# Altium project MCU_Control&ADDeteect2.PrjPcb
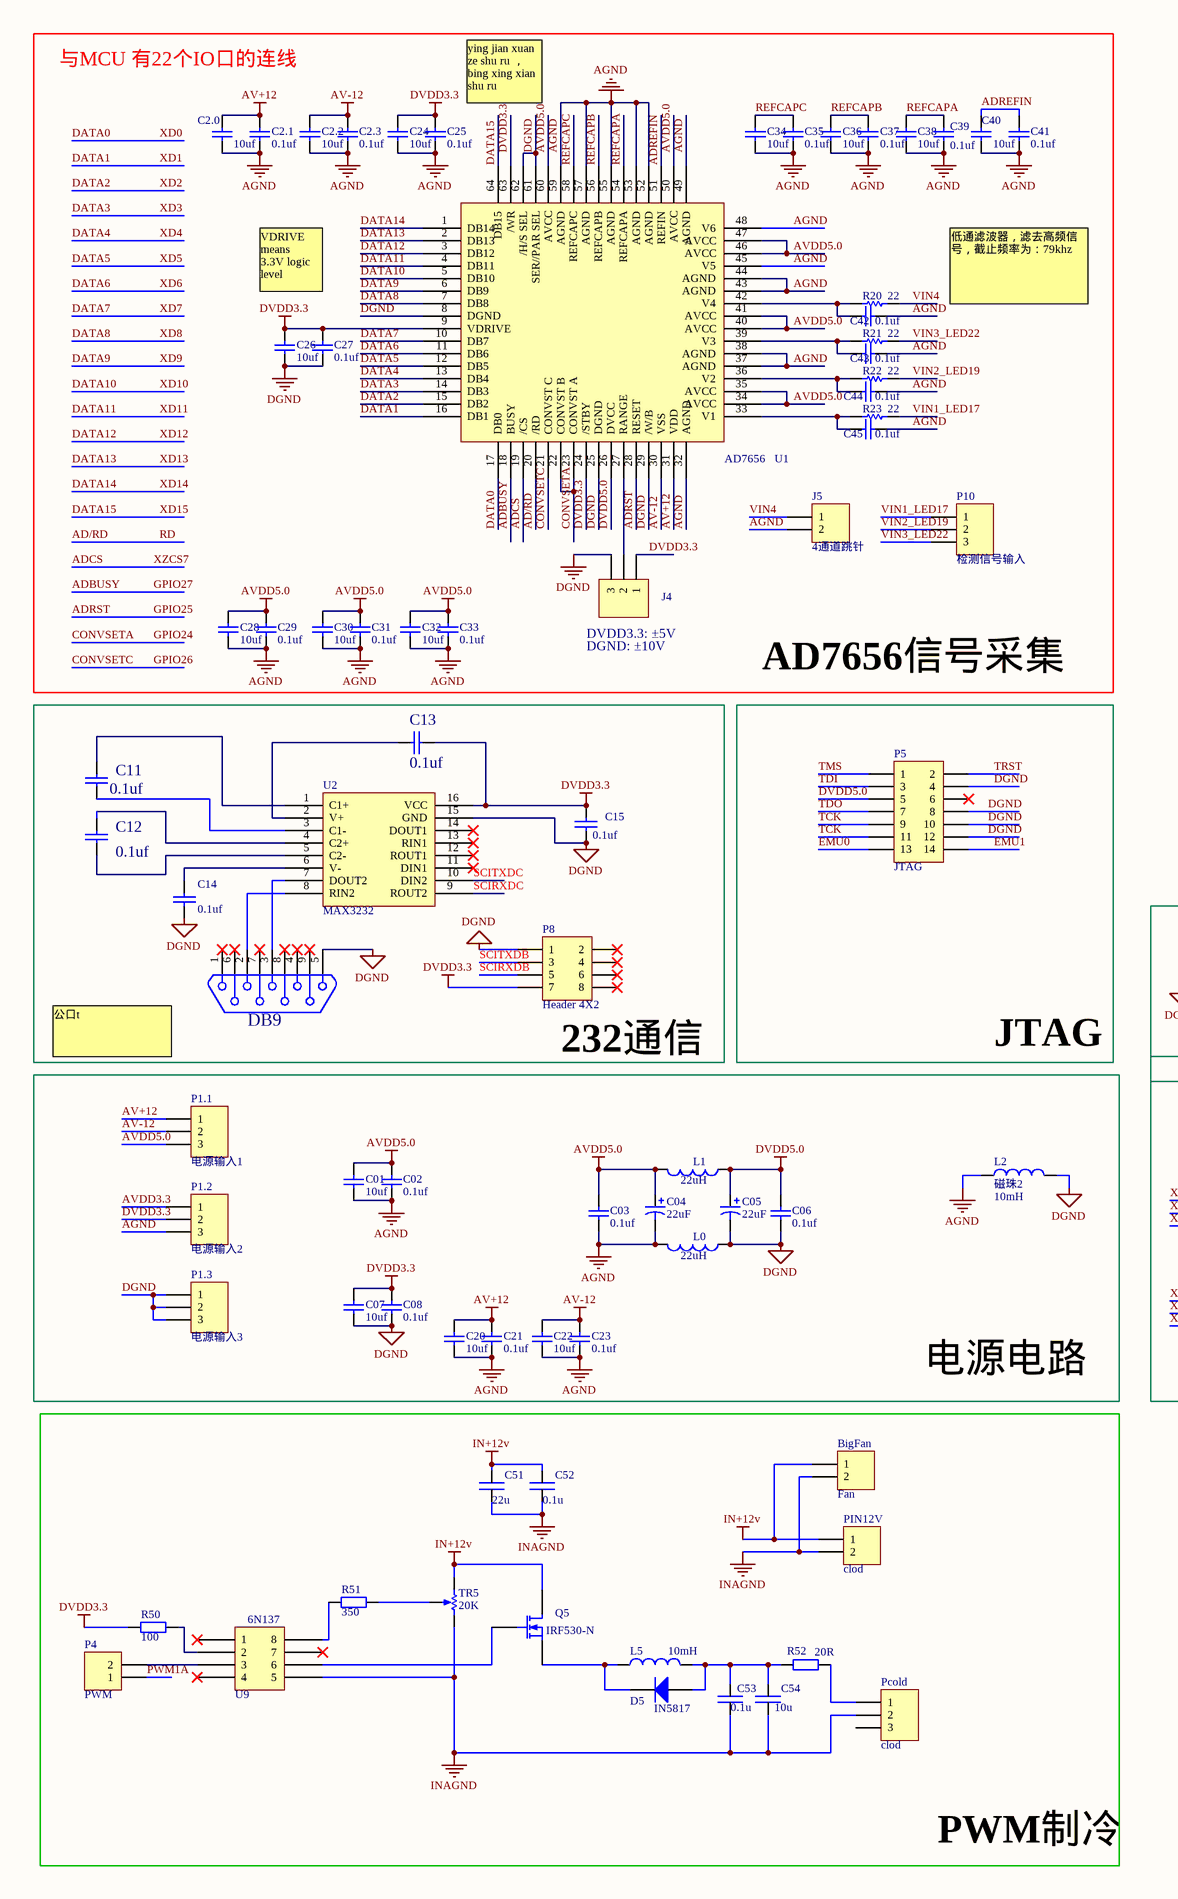
[diagram p0: MCU_Control_Board.SchDoc, left]
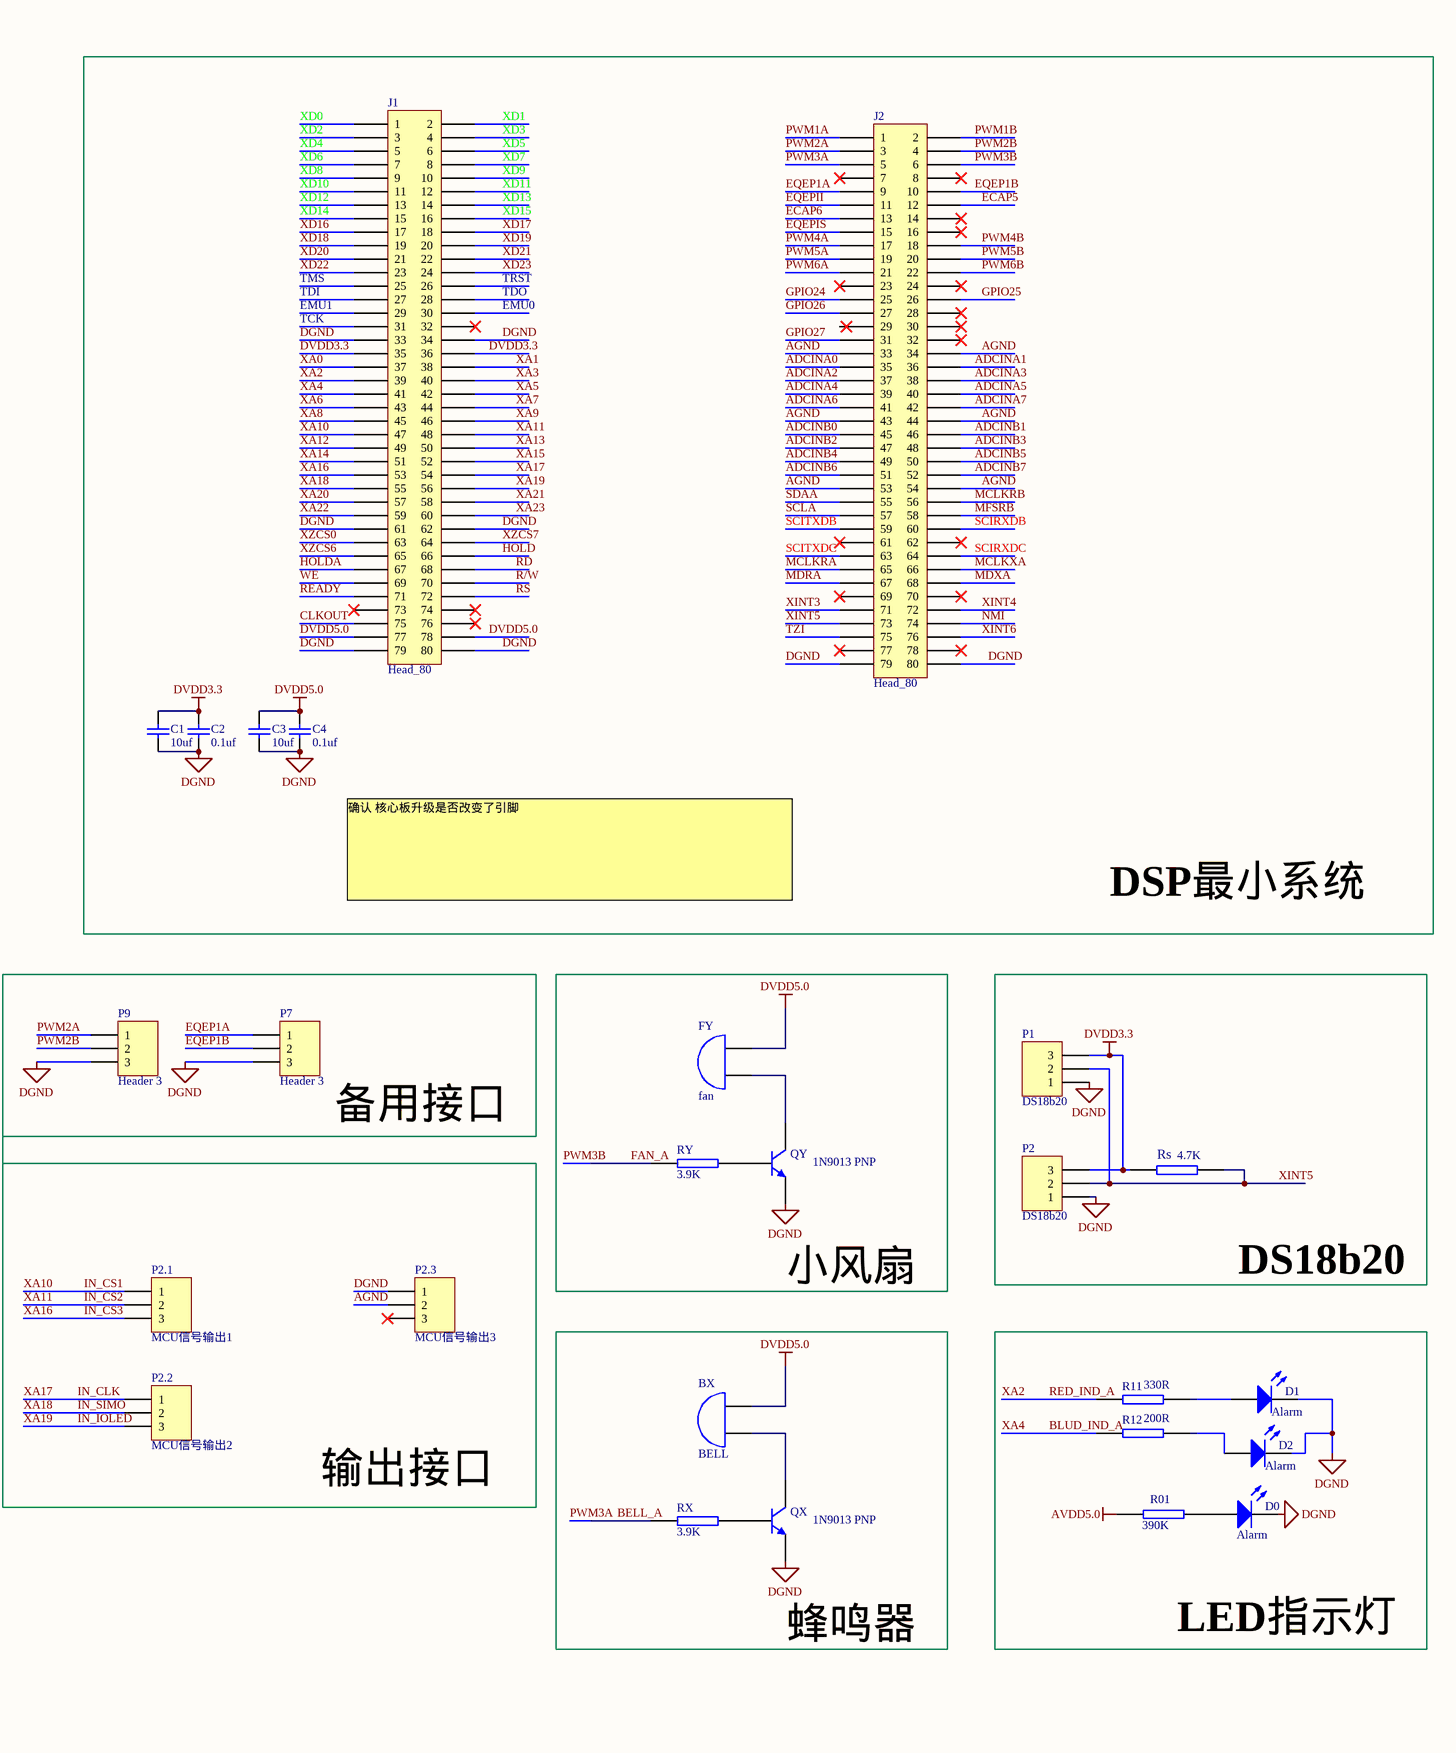
[diagram p1: MCU_Control_Board.SchDoc, right]
1 sheet, 103 parts. Net scope: global (net labels, ports and power ports of the same name join across sheets).
Board file: MCU_Control_Board.PcbDoc

## Sheet MCU_Control_Board.SchDoc
size A2

### Parts
BigFan  Fan  [HDR1X2]
BX  BELL  [Beep]
C01  value 10uf  [4*4.5 贴片电解电容]  (hidden comment: Cap)
C1  value 10uf  [CC0805]  (hidden comment: Cap)
C02  value 0.1uf  [CC0805]  (hidden comment: Cap)
C2  value 0.1uf  [CC0805]  (hidden comment: Cap)
C2.0  value 10uf  [0805-2]  (hidden comment: Cap)
C2.1  value 0.1uf  [0805-2]  (hidden comment: Cap)
C2.2  value 10uf  [0805-2]  (hidden comment: Cap)
C2.3  value 0.1uf  [0805-2]  (hidden comment: Cap)
C03  value 0.1uf  [CC0805]  (hidden comment: Cap)
C3  value 10uf  [CC0805]  (hidden comment: Cap)
C04  value 22uF  [CC0805]  (hidden comment: Cap Pol1)
C4  value 0.1uf  [CC0805]  (hidden comment: Cap)
C05  value 22uF  [CC0805]  (hidden comment: Cap Pol1)
C06  value 0.1uf  [cc0805]  (hidden comment: Cap)
C07  value 10uf  [4*4.5 贴片电解电容]  (hidden comment: Cap)
C08  value 0.1uf  [CC0805]  (hidden comment: Cap)
C11  0.1uf  [0805-2]
C12  0.1uf  [0805-2]
C13  0.1uf  [0805-2]
C14  0.1uf  [0805-2]
C15  0.1uf  [0805-2]
C20  value 10uf  [4*4.5 贴片电解电容]  (hidden comment: Cap)
C21  value 0.1uf  [0805-2]  (hidden comment: Cap)
C22  value 10uf  [4*4.5 贴片电解电容]  (hidden comment: Cap)
C23  value 0.1uf  [0805-2]  (hidden comment: Cap)
C24  value 10uf  [0805-2]  (hidden comment: Cap)
C25  value 0.1uf  [0805-2]  (hidden comment: Cap)
C26  value 10uf  [0805-2]  (hidden comment: Cap)
C27  value 0.1uf  [0805-2]  (hidden comment: Cap)
C28  value 10uf  [0805-2]  (hidden comment: Cap)
C29  value 0.1uf  [0805-2]  (hidden comment: Cap)
C30  value 10uf  [0805-2]  (hidden comment: Cap)
C31  value 0.1uf  [0805-2]  (hidden comment: Cap)
C32  value 10uf  [0805-2]  (hidden comment: Cap)
C33  value 0.1uf  [0805-2]  (hidden comment: Cap)
C34  value 10uf  [0805-2]  (hidden comment: Cap)
C35  value 0.1uf  [0805-2]  (hidden comment: Cap)
C36  value 10uf  [0805-2]  (hidden comment: Cap)
C37  value 0.1uf  [0805-2]  (hidden comment: Cap)
C38  value 10uf  [0805-2]  (hidden comment: Cap)
C39  value 0.1uf  [0805-2]  (hidden comment: Cap)
C40  value 10uf  [0805-2]  (hidden comment: Cap)
C41  value 0.1uf  [0805-2]  (hidden comment: 100u/25v)
C42  value 0.1uf  [0805]  (hidden comment: 0.1u)
C43  value 0.1uf  [0805]  (hidden comment: 0.1u)
C44  value 0.1uf  [0805]  (hidden comment: 0.1u)
C45  value 0.1uf  [0805]  (hidden comment: 0.1u)
C51  22u  [4*4.5 贴片电解电容]
C52  0.1u  [0805]
C53  0.1u  [0805]
C54  10u  [0805]
D0  Alarm  [LED_0805]
D1  Alarm  [LED_0805]
D2  Alarm  [LED_0805]
D5  IN5817  [DIODE-SMA]
DB9  DB9  [DB9]  (value not drawn)
FY  fan  [HDR1X2]
J1  Head_80  [SOP80]
J2  Head_80  [SOP80]
J4  Header 3H  [HDR1X3]  (value not drawn)
J5  4通道跳针  [HDR1X2]
L0  value 22uH  [1206]  (hidden comment: Inductor)
L1  value 22uH  [1206]  (hidden comment: Inductor)
L2  磁珠2  value 10mH  [1206]
L5  value 10mH  [1206]  (hidden comment: Inductor)
P1  DS18b20  [HDR1X3]
P1.1  电源输入1  [HDR1X3H]
P1.2  电源输入2  [HDR1X3H]
P1.3  电源输入3  [HDR1X3H]
P2  DS18b20  [HDR1X3]
P2.1  MCU信号输出1  [HDR1X3H]
P2.2  MCU信号输出2  [HDR1X3H]
P2.3  MCU信号输出3  [HDR1X3H]
P4  PWM  [HDR1X2]
P5  JTAG  [HDR2X7]
P7  Header 3  [HDR1X3]
P8  Header 4X2  [HDR2X4]
P9  Header 3  [HDR1X3]
P10  检测信号输入  [HDR1X3H]
Pcold  clod  [HDR1X3H]
PIN12V  clod  [HDR1X2]
Q5  IRF530-N  [TIP122-带卧式散热]
QX  1N9013 PNP  [sot-23]
QY  1N9013 PNP  [sot-23]
R01  390K  [0805]
R11  330R  [0805]
R12  200R  [0805]
R20  value 22  [0805-2]  (hidden comment: Res Semi)
R21  value 22  [0805-2]  (hidden comment: Res Semi)
R22  value 22  [0805-2]  (hidden comment: Res Semi)
R23  value 22  [0805-2]  (hidden comment: Res Semi)
R50  value 100  [0805]  (hidden comment: Res2)
R51  value 350  [0805]  (hidden comment: Res2)
R52  value 20R  [1206]  (hidden comment: Res2)
Rs  4.7K  [0805]
RX  3.9K  [0805-2]
RY  3.9K  [0805-2]
TR5  value 20K  [VR5]  (hidden comment: RPot)
U1  AD7656  [AD7656]
U2  MAX3232  [MAX3232]
U9  6N137  [SOIC8-KUANG]  (value not drawn)

### Blocks framed on the sheet
AD7656信号采集: C2.0-C2.3 C24-C45 J4 J5 P10 R20-R23 U1
DSP最小系统: C1-C4 J1 J2
232通信: C11-C15 DB9 P8 U2
小风扇: FY QY RY
DS18b20: P1 P2 Rs
电源电路: C01 C02 C03 C04 C05 C06 C07 C08 C20-C23 L0-L2 P1.1-P1.3
蜂鸣器: BX QX RX
LED指示灯: D0-D2 R01 R11 R12
PWM制冷: BigFan C51-C54 D5 L5 P4 Pcold PIN12V Q5 R50-R52 TR5 U9

### Nets
AGND: C01.1 C02.1 C2.0.1 C2.1.1 C2.2.1 C2.3.1 C03.2 C04.2 C20.1 C21.1 C22.1 C23.1 C24.1 C25.1 C28.1 C29.1 C30.1 C31.1 C32.1 C33.1 C34.1 C35.1 C36.1 C37.1 C38.1 C39.1 C40.1 C41.1 C42.1 C43.1 C44.1 C45.1 J2.33 J2.34 J2.43 J2.44 J2.53 J2.54 J5.2 L0.2 L2.1 P1.2.3 P2.3.2 U1.32(AGND) U1.37(AGND) U1.38(AGND) U1.43(AGND) U1.44(AGND) U1.45(V5) U1.48(V6) U1.49(AGND) U1.52(AGND) U1.53(AGND) U1.55(AGND) U1.57(AGND) U1.59(AGND)
AV+12: C2.0.2 C2.1.2 C20.2 C21.2 P1.1.1 U1.31(VDD)
AV-12: C2.2.2 C2.3.2 C22.2 C23.2 P1.1.2 U1.30(VSS)
AVDD5.0: C01.2 C02.2 C03.1 C04.1 C28.2 C29.2 C30.2 C31.2 C32.2 C33.2 L1.2 P1.1.3 R01.2 U1.34(AVCC) U1.35(AVCC) U1.40(AVCC) U1.41(AVCC) U1.46(AVCC) U1.47(AVCC) U1.50(AVCC) U1.60(AVCC)
DGND: C1.1 C2.1 C3.1 C4.1 C05.2 C06.2 C07.1 C08.1 C14.2 C15.2 C26.2 C27.2 D0.2(K) D1.2(K) D2.2(K) DB9.5 J1.33 J1.34 J1.61 J1.62 J1.79 J1.80 J2.79 J2.80 J4.3 L0.1 L2.2 P1.1 P1.3.1 P1.3.2 P1.3.3 P2.1 P2.3.1 P5.4 P5.8 P5.10 P5.12 P7.3 P8.1 P9.3 QX.2(E) QY.2(E) U1.8(DGND) U1.25(DGND) U1.29(/W/B) U1.61(SER//PAR_SEL) U1.62(/H/S_SEL) U2.15(GND)
DVDD3.3: C1.2 C2.2 C07.2 C08.2 C13.1 C15.1 C24.2 C25.2 C26.1 C27.1 J1.35 J1.36 J4.1 P1.3 P1.2.2 P2.3 P8.7 R50.2 Rs.2 U1.9(VDRIVE) U1.24(/STBY) U1.63(/WR) U2.16(VCC)
DVDD5.0: BX.1(B) C3.2 C4.2 C05.1 C06.1 FY.1(B) J1.77 J1.78 L1.1 P5.5 U1.26(DVCC)
IN+12v: BigFan.1 C51.1 C52.1 PIN12V.1 Q5.2(D) TR5.1(TOP)
INAGND: BigFan.2 C51.2 C52.2 C53.2 C54.2 Pcold.2 PIN12V.2 TR5.3(BOT) U9.5
AD/RD: J1.68 U1.20(/RD)  [also labelled RD]
ADBUSY: J2.31 U1.18(BUSY)  [also labelled GPIO27]
ADCINA0: J2.35
ADCINA1: J2.36
ADCINA2: J2.37
ADCINA3: J2.38
ADCINA4: J2.39
ADCINA5: J2.40
ADCINA6: J2.41
ADCINA7: J2.42
ADCINB0: J2.45
ADCINB1: J2.46
ADCINB2: J2.47
ADCINB3: J2.48
ADCINB4: J2.49
ADCINB5: J2.50
ADCINB6: J2.51
ADCINB7: J2.52
ADCS: J1.64 U1.19(/CS)  [also labelled XZCS7]
ADREFIN: C40.2 C41.2 U1.51(REFIN)
ADRST: J2.26 U1.28(RESET)  [also labelled GPIO25]
AVDD3.3: P1.2.1
BELL_A: J2.5 RX.1  [also labelled PWM3A]
BLUD_IND_A: J1.41 R12.2  [also labelled XA4]
CLKOUT: J1.75
CONVSETA: J2.25 U1.22(CONVST_B) U1.23(CONVST_A)  [also labelled GPIO24]
CONVSETC: J2.27 U1.21(CONVST_C)  [also labelled GPIO26]
DATA0: J1.1 U1.17(DB0)  [also labelled XD0]
DATA1: J1.2 U1.16(DB1)  [also labelled XD1]
DATA2: J1.3 U1.15(DB2)  [also labelled XD2]
DATA3: J1.4 U1.14(DB3)  [also labelled XD3]
DATA4: J1.5 U1.13(DB4)  [also labelled XD4]
DATA5: J1.6 U1.12(DB5)  [also labelled XD5]
DATA6: J1.7 U1.11(DB6)  [also labelled XD6]
DATA7: J1.8 U1.10(DB7)  [also labelled XD7]
DATA8: J1.9 U1.7(DB8)  [also labelled XD8]
DATA9: J1.10 U1.6(DB9)  [also labelled XD9]
DATA10: J1.11 U1.5(DB10)  [also labelled XD10]
DATA11: J1.12 U1.4(DB11)  [also labelled XD11]
DATA12: J1.13 U1.3(DB12)  [also labelled XD12]
DATA13: J1.14 U1.2(DB13)  [also labelled XD13]
DATA14: J1.15 U1.1(DB14)  [also labelled XD14]
DATA15: J1.16 U1.64(DB15)  [also labelled XD15]
ECAP5: J2.12
ECAP6: J2.13
EMU0: J1.30 P5.13
EMU1: J1.29 P5.14
EQEP1A: J2.9 P7.1
EQEP1B: J2.10 P7.2
EQEPII: J2.11
EQEPIS: J2.15
FAN_A: J2.6 RY.1  [also labelled PWM3B]
HOLD: J1.66
HOLDA: J1.67
IN_CLK: J1.54 P2.2.1  [also labelled XA17]
IN_CS1: J1.47 P2.1.1  [also labelled XA10]
IN_CS2: J1.48 P2.1.2  [also labelled XA11]
IN_CS3: J1.53 P2.1.3  [also labelled XA16]
IN_IOLED: J1.56 P2.2.3  [also labelled XA19]
IN_SIMO: J1.55 P2.2.2  [also labelled XA18]
MCLKRA: J2.65
MCLKRB: J2.56
MCLKXA: J2.66
MDRA: J2.67
MDXA: J2.68
MFSRB: J2.58
NMI: J2.74
PWM1A: J2.1 P4.1
PWM1B: J2.2
PWM2A: J2.3 P9.1
PWM2B: J2.4 P9.2
PWM4A: J2.17
PWM4B: J2.18
PWM5A: J2.19
PWM5B: J2.20
PWM6A: J2.21
PWM6B: J2.22
R/W: J1.70
READY: J1.71
RED_IND_A: J1.39 R11.2  [also labelled XA2]
REFCAPA: C38.2 C39.2 U1.54(REFCAPA)
REFCAPB: C36.2 C37.2 U1.56(REFCAPB)
REFCAPC: C34.2 C35.2 U1.58(REFCAPC)
RS: J1.72
SCIRXDB: J2.60 P8.5
SCIRXDC: J2.64 U2.9(ROUT2)
SCITXDB: J2.59 P8.3
SCITXDC: J2.63 U2.10(DIN2)
SCLA: J2.57
SDAA: J2.55
TCK: J1.31 P5.9 P5.11
TDI: J1.27 P5.3
TDO: J1.28 P5.7
TMS: J1.25 P5.1
TRST: J1.26 P5.2
TZI: J2.75
VIN1_LED17: P10.1 R23.2
VIN2_LED19: P10.2 R22.2
VIN3_LED22: P10.3 R21.2
VIN4: J5.1 R20.2
WE: J1.69
XA0: J1.37
XA1: J1.38
XA3: J1.40
XA5: J1.42
XA6: J1.43
XA7: J1.44
XA8: J1.45
XA9: J1.46
XA12: J1.49
XA13: J1.50
XA14: J1.51
XA15: J1.52
XA20: J1.57
XA21: J1.58
XA22: J1.59
XA23: J1.60
XD16: J1.17
XD17: J1.18
XD18: J1.19
XD19: J1.20
XD20: J1.21
XD21: J1.22
XD22: J1.23
XD23: J1.24
XINT3: J2.71
XINT4: J2.72
XINT5: J2.73 P1.2 P2.2 Rs.1
XINT6: J2.76
XZCS0: J1.63
XZCS6: J1.65
NetBX_2: BX.2(A) QX.3(C)
NetC11_1: C11.1 U2.3(C1-)
NetC11_2: C11.2 U2.1(C1+)
NetC12_1: C12.1 U2.5(C2-)
NetC12_2: C12.2 U2.4(C2+)
NetC13_2: C13.2 U2.2(V+)
NetC14_1: C14.1 U2.6(V-)
NetC42_2: C42.2 R20.1 U1.42(V4)
NetC43_2: C43.2 R21.1 U1.39(V3)
NetC44_2: C44.2 R22.1 U1.36(V2)
NetC45_2: C45.2 R23.1 U1.33(V1)
NetC53_1: C53.1 C54.1 D5.1(A) L5.2 R52.1
NetD0_1: D0.1(A) R01.1
NetD1_1: D1.1(A) R11.1
NetD2_1: D2.1(A) R12.1
NetD5_2: D5.2(K) L5.1 Q5.3(S)
NetDB9_2: DB9.2 U2.8(RIN2)
NetDB9_3: DB9.3 U2.7(DOUT2)
NetFY_2: FY.2(A) QY.3(C)
NetJ4_2: J4.2 U1.27(RANGE)
NetP4_2: P4.2 U9.3
NetPcold_1: Pcold.1 R52.2
NetQ5_1: Q5.1(G) U9.6
NetQX_1: QX.1(B) RX.2
NetQY_1: QY.1(B) RY.2
NetR50_1: R50.1 U9.2
NetR51_1: R51.1 TR5.2(TAP)
NetR51_2: R51.2 U9.8

Not connected (* = marked no-connect by the designer): DB9 1* 4* 6* 7* 8* 9*; J1 32* 73* 74* 76*; J2 7* 8* 14* 16* 23* 24* 28* 29 30* 32* 61* 62* 69* 70* 77* 78*; P2.3 3*; P5 6*; P8 2* 4* 6* 8*; Pcold 3; U2 11(DIN1)* 12(ROUT1)* 13(RIN1)* 14(DOUT1)*; U9 1* 4* 7*

### Notes on the sheet
- 与MCU 有22个IO口的连线
- (near C25) ying jian xuan ze shu ru ，bing xing xian shu ru
- VDRIVE means
  3.3V logic level
- 低通滤波器，滤去高频信号，截止频率为：79khz
- (near J4) A control V1&V2;B control V3&V4,C control V5&V6
- (near J4) DVDD3.3: ±5V
- DGND: ±10V
- 确认 核心板升级是否改变了引脚
- 公口t
- JTAG
- 备用接口
- 5V   0.3W
- 输出接口

### Library data of the parts
BigFan J5 P4 PIN12V = Header 2: Header, 2-Pin; LatestRevisionDate: 17-Jul-2002; LatestRevisionNote: Re-released for DXP Platform.; Publisher: Altium Limited
C01 C1 C02 C2 C2.0-C2.3 C03 C3 C4 C06 C07 C08 C20-C45 = Cap: Capacitor; Published: 8-Jun-2000; LatestRevisionDate: 17-Jul-2002; LatestRevisionNote: Re-released for DXP Platform.; PackageReference: RAD-0.3; Publisher: Altium Limited
C04 C05 = Cap Pol1: Polarized Capacitor (Radial); Published: 8-Jun-2000; LatestRevisionDate: 17-Jul-2002; LatestRevisionNote: Re-released for DXP Platform.; PackageReference: RB7.6-15; Publisher: Altium Limited
C11-C13 = Pro1AD.tmp_0.01uf_15
C14 C15 = CAP: Capacitor
C51-C54 = Cap
D0-D2 = LED0: Typical INFRARED GaAs LED; Published: 8-Jun-2000; LatestRevisionDate: 08-Jul-2005; LatestRevisionNote: Mech Layer 1 removed.; PackageReference: LED-0; Publisher: Altium Limited
D5 = Diode BAS21: Silicon Switching Diode for High-Speed, High-Voltage Switching; Note: Pin 2 is not connected and not drawn.; Published: 21-Mar-2003; DatasheetDocument: Oct-1999; PackageDocument: Sep-2001; PackageReference: SOT-23; Publisher: Altium Limited; ComponentLink1Description: Manufacturer Link; ComponentLink1URL: http://www.infineon.com/; ComponentLink2Description: Datasheet; ComponentLink2URL: http://www.infineon.com/upload/Document/cmc_upload/documents/080/812/bas21series.pdf
FY = BELL
J4 P1.1-P1.3 P2 P2.1-P2.3 P10 Pcold = Header 3H: Header, 3-Pin, Right Angle; LatestRevisionDate: 17-Jul-2002; LatestRevisionNote: Re-released for DXP Platform.; Publisher: Altium Limited
L0-L2 L5 = Inductor: Code_IEC: 1005; Published: 8-Jun-2000; PackageReference: 0402-A; Publisher: Altium Limited; Code_JEITA: 0402
  L0 L1: LatestRevisionDate: 29-May-2009; LatestRevisionNote: IPC-7351 Footprint Added.; PackageDescription: Chip Inductor
  L2 L5: LatestRevisionDate: 17-Jul-2002; LatestRevisionNote: Re-released for DXP Platform.
P1 P7 P9 = Header 3: Header, 3-Pin; LatestRevisionDate: 17-Jul-2002; LatestRevisionNote: Re-released for DXP Platform.; Publisher: Altium Limited
P5 = Header 7X2: Header, 7-Pin, Dual row; LatestRevisionDate: 17-Jul-2002; LatestRevisionNote: Re-released for DXP Platform.; Publisher: Altium Limited
P8 = Header 4X2: Header, 4-Pin, Dual row; LatestRevisionDate: 17-Jul-2002; LatestRevisionNote: Re-released for DXP Platform.; Publisher: Altium Limited
Q5 = MOSFET-N: N-Channel MOSFET; PackageDocument: 1995/1996; Published: 8-Jun-2000; LatestRevisionDate: 17-Jul-2002; LatestRevisionNote: Re-released for DXP Platform.; PackageReference: E3; Publisher: Altium Limited
QX QY = 2N3904: NPN General Purpose Amplifier; Published: 8-Jun-2000; LatestRevisionDate: 15-Jan-2003; LatestRevisionNote: PCB Footprint 'BCY-W3/D4.7' replaced; DatasheetDocument: 1997; PackageDocument: Sep-1998; PackageReference: TO-92A; Publisher: Altium Limited; Code_JEDEC: TO-92A; ComponentLink1Description: Manufacturer Link; ComponentLink1URL: http://www.fairchildsemi.com/; ComponentLink2Description: Datasheet; ComponentLink2URL: http://www.fairchildsemi.com/ds/2N%2F2N3904.pdf
R01 R11 R12 Rs RX RY = RES2
R20-R23 = Res Semi: Semiconductor Resistor; Published: 8-Jun-2000; LatestRevisionDate: 17-Jul-2002; LatestRevisionNote: Re-released for DXP Platform.; PackageReference: AXIAL-0.5; Publisher: Altium Limited
R50-R52 = Res2: Resistor; Published: 8-Jun-2000; LatestRevisionDate: 17-Jul-2002; LatestRevisionNote: Re-released for DXP Platform.; PackageReference: AXIAL-0.4; Publisher: Altium Limited
TR5 = RPot: Potentiometer; Sim Note: Enter the Resistance value and the set point into parameter fields.; Set Position: 0.5; Published: 8-Jun-2000; LatestRevisionDate: 17-Jul-2002; LatestRevisionNote: Re-released for DXP Platform.; PackageReference: VR5; Publisher: Altium Limited